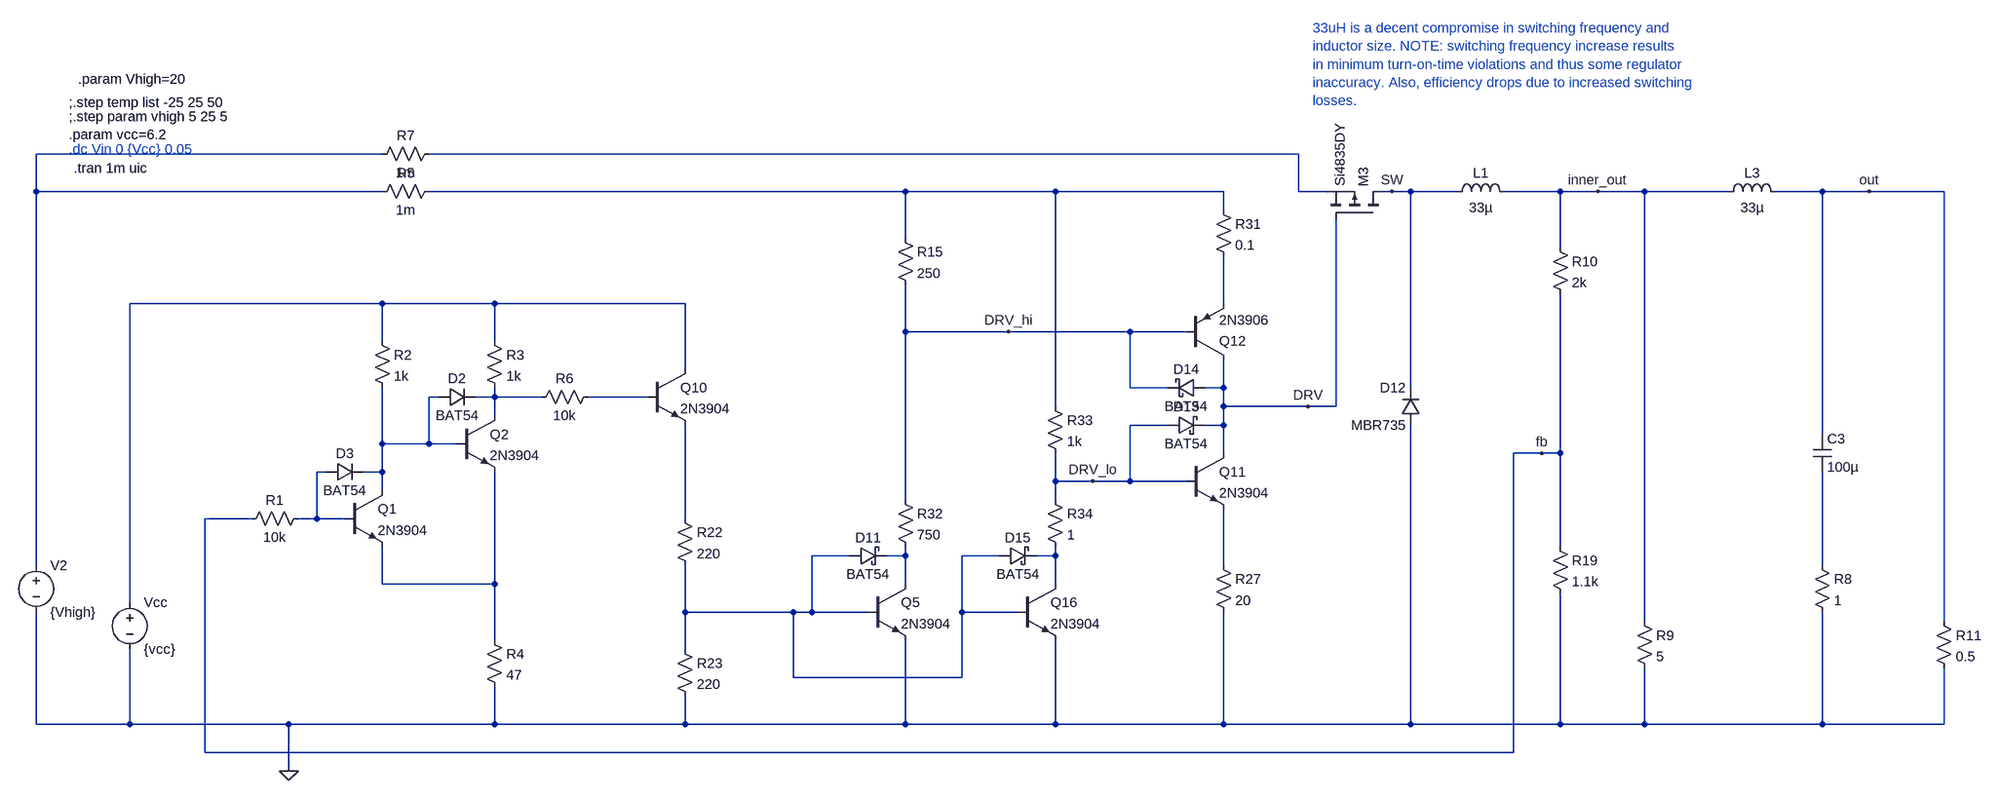
[diagram p0: schematic hyst_voltage_regulator1.asc]
hyst_voltage_regulator1.asc, the LTspice schematic file:
Version 4.1
SHEET 1 5252 3804
WIRE 208 -496 -384 -496
WIRE 2000 -496 288 -496
WIRE -384 -432 -384 -496
WIRE 208 -432 -384 -432
WIRE 1328 -432 288 -432
WIRE 1584 -432 1328 -432
WIRE 1872 -432 1584 -432
WIRE 2000 -432 2000 -496
WIRE 2048 -432 2000 -432
WIRE 2160 -432 2144 -432
WIRE 2192 -432 2160 -432
WIRE 2272 -432 2192 -432
WIRE 2448 -432 2352 -432
WIRE 2512 -432 2448 -432
WIRE 2592 -432 2512 -432
WIRE 2736 -432 2592 -432
WIRE 2896 -432 2816 -432
WIRE 2976 -432 2896 -432
WIRE 3104 -432 2976 -432
WIRE 1872 -400 1872 -432
WIRE 1328 -352 1328 -432
WIRE 2448 -336 2448 -432
WIRE 208 -240 -224 -240
WIRE 400 -240 208 -240
WIRE 864 -240 400 -240
WIRE 1872 -240 1872 -320
WIRE 1328 -192 1328 -272
WIRE 1504 -192 1328 -192
WIRE 1712 -192 1504 -192
WIRE 1808 -192 1712 -192
WIRE 208 -176 208 -240
WIRE 400 -176 400 -240
WIRE 864 -128 864 -240
WIRE 1712 -96 1712 -192
WIRE 1776 -96 1712 -96
WIRE 1872 -96 1872 -144
WIRE 1872 -96 1840 -96
WIRE 2192 -96 2192 -432
WIRE 304 -80 288 -80
WIRE 400 -80 400 -96
WIRE 400 -80 368 -80
WIRE 480 -80 400 -80
WIRE 800 -80 560 -80
WIRE 1584 -64 1584 -432
WIRE 1872 -64 1872 -96
WIRE 2016 -64 1872 -64
WIRE 2064 -64 2064 -384
WIRE 2064 -64 2016 -64
WIRE 400 -48 400 -80
WIRE 1776 -32 1712 -32
WIRE 1872 -32 1872 -64
WIRE 1872 -32 1840 -32
WIRE 2896 -16 2896 -432
WIRE 208 0 208 -96
WIRE 288 0 288 -80
WIRE 288 0 208 0
WIRE 336 0 288 0
WIRE 1872 16 1872 -32
WIRE 2416 16 2368 16
WIRE 2448 16 2448 -256
WIRE 2448 16 2416 16
WIRE 112 48 96 48
WIRE 208 48 208 0
WIRE 208 48 176 48
WIRE 1584 64 1584 16
WIRE 1648 64 1584 64
WIRE 1712 64 1712 -32
WIRE 1712 64 1648 64
WIRE 1808 64 1712 64
WIRE 208 80 208 48
WIRE 1328 96 1328 -192
WIRE 1584 96 1584 64
WIRE -16 128 -96 128
WIRE 96 128 96 48
WIRE 96 128 64 128
WIRE 144 128 96 128
WIRE 864 128 864 -32
WIRE 2448 176 2448 16
WIRE 1232 192 1168 192
WIRE 1328 192 1328 176
WIRE 1328 192 1296 192
WIRE 1488 192 1424 192
WIRE 1584 192 1584 176
WIRE 1584 192 1552 192
WIRE -384 208 -384 -432
WIRE 1872 208 1872 112
WIRE 2896 208 2896 48
WIRE 208 240 208 176
WIRE 400 240 400 48
WIRE 400 240 208 240
WIRE 1328 240 1328 192
WIRE 1584 240 1584 192
WIRE -224 272 -224 -240
WIRE 864 288 864 208
WIRE 1136 288 864 288
WIRE 1168 288 1168 192
WIRE 1168 288 1136 288
WIRE 1264 288 1168 288
WIRE 1424 288 1424 192
WIRE 1520 288 1424 288
WIRE 2592 304 2592 -432
WIRE 3104 304 3104 -432
WIRE 400 336 400 240
WIRE 864 352 864 288
WIRE 1136 400 1136 288
WIRE 1424 400 1424 288
WIRE 1424 400 1136 400
WIRE -384 480 -384 288
WIRE -224 480 -224 352
WIRE -224 480 -384 480
WIRE 48 480 -224 480
WIRE 400 480 400 416
WIRE 400 480 48 480
WIRE 864 480 864 432
WIRE 864 480 400 480
WIRE 1328 480 1328 336
WIRE 1328 480 864 480
WIRE 1584 480 1584 336
WIRE 1584 480 1328 480
WIRE 1872 480 1872 288
WIRE 1872 480 1584 480
WIRE 2192 480 2192 -32
WIRE 2192 480 1872 480
WIRE 2448 480 2448 256
WIRE 2448 480 2192 480
WIRE 2592 480 2592 384
WIRE 2592 480 2448 480
WIRE 2896 480 2896 288
WIRE 2896 480 2592 480
WIRE 3104 480 3104 384
WIRE 3104 480 2896 480
WIRE -96 528 -96 128
WIRE 2368 528 2368 16
WIRE 2368 528 -96 528
WIRE 48 560 48 480
FLAG 48 560 0
FLAG 2512 -432 inner_out
FLAG 2416 16 fb
FLAG 2976 -432 out
FLAG 1504 -192 DRV_hi
FLAG 2016 -64 DRV
FLAG 2160 -432 SW
FLAG 1648 64 DRV_lo
SYMBOL npn 144 80 R0
SYMATTR InstName Q1
SYMATTR Value 2N3904
SYMBOL npn 336 -48 R0
SYMATTR InstName Q2
SYMATTR Value 2N3904
SYMBOL voltage -224 256 R0
SYMATTR InstName Vcc
SYMATTR Value {vcc}
SYMBOL res 192 -192 R0
SYMATTR InstName R2
SYMATTR Value 1k
SYMBOL res 384 -192 R0
SYMATTR InstName R3
SYMATTR Value 1k
SYMBOL res 384 320 R0
SYMATTR InstName R4
SYMATTR Value 47
SYMBOL res 80 112 R90
WINDOW 0 0 56 VBottom 2
WINDOW 3 32 56 VTop 2
SYMATTR InstName R1
SYMATTR Value 10k
SYMBOL voltage -384 192 R0
SYMATTR InstName V2
SYMATTR Value {Vhigh}
SYMBOL res 576 -96 R90
WINDOW 0 0 56 VBottom 2
WINDOW 3 32 56 VTop 2
SYMATTR InstName R6
SYMATTR Value 10k
SYMBOL diode 304 -64 R270
WINDOW 0 32 32 VTop 2
WINDOW 3 0 32 VBottom 2
SYMATTR InstName D2
SYMATTR Value BAT54
SYMBOL diode 112 64 R270
WINDOW 0 32 32 VTop 2
WINDOW 3 0 32 VBottom 2
SYMATTR InstName D3
SYMATTR Value BAT54
SYMBOL ind 2256 -416 R270
WINDOW 0 32 56 VTop 2
WINDOW 3 4 56 VBottom 2
SYMATTR InstName L1
SYMATTR Value 33µ
SYMATTR SpiceLine Rser=1m
SYMBOL res 3088 288 R0
SYMATTR InstName R11
SYMATTR Value 0.5
SYMBOL res 2432 -352 R0
SYMATTR InstName R10
SYMATTR Value 2k
SYMBOL res 2432 160 R0
SYMATTR InstName R19
SYMATTR Value 1.1k
SYMBOL ind 2720 -416 R270
WINDOW 0 32 56 VTop 2
WINDOW 3 4 56 VBottom 2
SYMATTR InstName L3
SYMATTR Value 33µ
SYMATTR SpiceLine Rser=1m
SYMBOL cap 2880 -16 R0
SYMATTR InstName C3
SYMATTR Value 100µ
SYMBOL res 2880 192 R0
SYMATTR InstName R8
SYMATTR Value 1
SYMBOL res 2576 288 R0
SYMATTR InstName R9
SYMATTR Value 5
SYMBOL npn 1264 240 R0
SYMATTR InstName Q5
SYMATTR Value 2N3904
SYMBOL schottky 1232 208 R270
WINDOW 0 32 32 VTop 2
WINDOW 3 0 32 VBottom 2
SYMATTR InstName D11
SYMATTR Value BAT54
SYMATTR Description Diode
SYMATTR Type diode
SYMBOL npn 800 -128 R0
SYMATTR InstName Q10
SYMATTR Value 2N3904
SYMBOL res 1312 -368 R0
SYMATTR InstName R15
SYMATTR Value 250
SYMBOL res 848 112 R0
SYMATTR InstName R22
SYMATTR Value 220
SYMBOL res 848 336 R0
SYMATTR InstName R23
SYMATTR Value 220
SYMBOL npn 1808 16 R0
SYMATTR InstName Q11
SYMATTR Value 2N3904
SYMBOL pnp 1808 -144 M180
SYMATTR InstName Q12
SYMATTR Value 2N3906
SYMBOL diode 2208 -32 R180
WINDOW 0 24 64 Left 2
WINDOW 3 24 0 Left 2
SYMATTR InstName D12
SYMATTR Value MBR735
SYMBOL schottky 1776 -16 R270
WINDOW 0 32 32 VTop 2
WINDOW 3 0 32 VBottom 2
SYMATTR InstName D13
SYMATTR Value BAT54
SYMATTR Description Diode
SYMATTR Type diode
SYMBOL schottky 1840 -80 M270
WINDOW 0 32 32 VTop 2
WINDOW 3 0 32 VBottom 2
SYMATTR InstName D14
SYMATTR Value BAT54
SYMATTR Description Diode
SYMATTR Type diode
SYMBOL res 1856 192 R0
SYMATTR InstName R27
SYMATTR Value 20
SYMBOL pmos 2144 -384 M270
SYMATTR InstName M3
SYMATTR Value Si4835DY
SYMBOL res 1856 -416 R0
SYMATTR InstName R31
SYMATTR Value 0.1
SYMBOL res 1312 80 R0
SYMATTR InstName R32
SYMATTR Value 750
SYMBOL npn 1520 240 R0
SYMATTR InstName Q16
SYMATTR Value 2N3904
SYMBOL schottky 1488 208 R270
WINDOW 0 32 32 VTop 2
WINDOW 3 0 32 VBottom 2
SYMATTR InstName D15
SYMATTR Value BAT54
SYMATTR Description Diode
SYMATTR Type diode
SYMBOL res 1568 -80 R0
SYMATTR InstName R33
SYMATTR Value 1k
SYMBOL res 1568 80 R0
SYMATTR InstName R34
SYMATTR Value 1
SYMBOL res 304 -448 R90
WINDOW 0 0 56 VBottom 2
WINDOW 3 32 56 VTop 2
SYMATTR InstName R5
SYMATTR Value 1m
SYMBOL res 304 -512 R90
WINDOW 0 0 56 VBottom 2
WINDOW 3 32 56 VTop 2
SYMATTR InstName R7
SYMATTR Value 1m
TEXT -328 -504 Left 2 ;.dc Vin 0 {Vcc} 0.05
TEXT -328 -560 Left 2 !;.step param vhigh 5 25 5\n.param vcc=6.2
TEXT -328 -584 Left 2 !;.step temp list -25 25 50
TEXT -320 -472 Left 2 !.tran 1m uic
TEXT 2024 -712 Left 2 ;33uH is a decent compromise in switching frequency and\ninductor size. NOTE: switching frequency increase results\nin minimum turn-on-time violations and thus some regulator\ninaccuracy. Also, efficiency drops due to increased switching\nlosses.
TEXT -312 -624 Left 2 !.param Vhigh=20

The netlist it stands for:
* hyst_voltage_regulator1.asc
Q1 N006 N009 N016 0 2N3904
Q2 N007 N006 N016 0 2N3904
Vcc N004 0 {vcc}
R2 N004 N006 1k
R3 N004 N007 1k
R4 N016 0 47
R1 N009 fb 10k
V2 N001 0 {Vhigh}
R6 N008 N007 10k
D2 N006 N007 BAT54
D3 N009 N006 BAT54
L1 SW inner_out 33µ Rser=1m
R11 out 0 0.5
R10 inner_out fb 2k
R19 fb 0 1.1k
L3 inner_out out 33µ Rser=1m
C3 out N015 100µ
R8 N015 0 1
R9 inner_out 0 5
Q5 N012 N011 0 0 2N3904
D11 N011 N012 BAT54
Q10 N004 N008 N010 0 2N3904
R15 N003 DRV_hi 250
R22 N010 N011 220
R23 N011 0 220
Q11 DRV DRV_lo N014 0 2N3904
Q12 DRV DRV_hi N005 0 2N3906
D12 0 SW MBR735
D13 DRV_lo DRV BAT54
D14 DRV DRV_hi BAT54
R27 N014 0 20
M3 SW DRV N002 N002 Si4835DY
R31 N003 N005 0.1
R32 DRV_hi N012 750
Q16 N013 N011 0 0 2N3904
D15 N011 N013 BAT54
R33 N003 DRV_lo 1k
R34 DRV_lo N013 1
R5 N003 N001 1m
R7 N002 N001 1m
.model D D
.lib standard.dio
.model NPN NPN
.model PNP PNP
.lib standard.bjt
.model NMOS NMOS
.model PMOS PMOS
.lib standard.mos
* .dc Vin 0 {Vcc} 0.05
;.step param vhigh 5 25 5
.param vcc=6.2
;.step temp list -25 25 50
.tran 1m uic
* 33uH is a decent compromise in switching frequency and
* inductor size. NOTE: switching frequency increase results
* in minimum turn-on-time violations and thus some regulator
* inaccuracy. Also, efficiency drops due to increased switching
* losses.
.param Vhigh=20
.backanno
.end